# Altium project 555metronome.PrjPcb
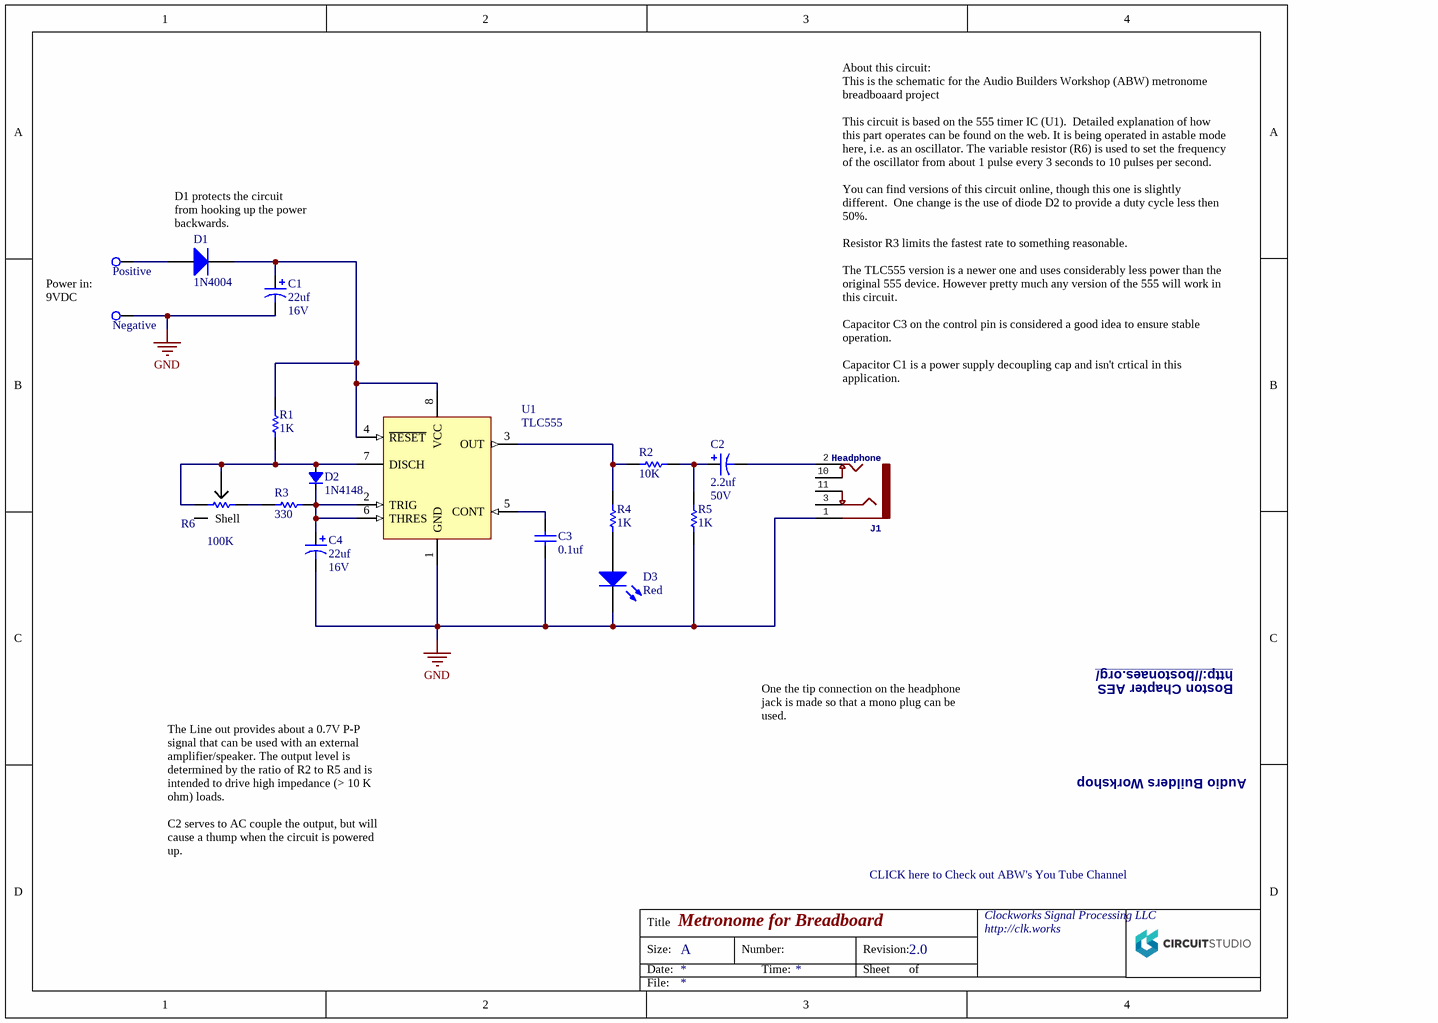
[diagram p0: met.breadboard.SchDoc]
1 sheet, 17 parts. Net scope: global (net labels, ports and power ports of the same name join across sheets).

## Sheet met.breadboard.SchDoc: Metronome for Breadboard
size A; Organization: Clockworks Signal Processing LLC; Address1: http://clk.works; Revision: 2.0

### Parts
C1  22uf  Voltage: 16V  [SL Radial cap 2mm. 5Dx11.2mm]
C2  2.2uf  Voltage: 50V  [SL Radial cap 2mm. 5Dx11.2mm Brown]
C3  0.1uf  [SL 3.8mm TH 5.1mm lead space]
C4  22uf  Voltage: 16V  [SL Radial cap 2mm. 5Dx11.2mm]
D1  1N4004  [SL DO-41]
D2  1N4148  [SL DO-35]
D3  value Red  [SL Green T13/4 LED]  (hidden comment: SL-D0006-A)
J1  Headphone  [SWITCHCRAFT_35RAPC4BHN2]
R1  1K  [SL Axial 1k 1/4W]
R2  10K  [SL Axial 10k 1/4W]
R3  330  [SL Axial 330 1/4W]
R4  1K  [SL Axial 1k 1/4W]
R5  1K  [SL Axial 1k 1/4W]
R6  100K  [SL 9MM POT]
TP1  Positive  [SL TEST POINT]  (no BOM)
TP2  Negative  [SL TEST POINT]  (no BOM)
U1  TLC555  [SL P0008A]

### Nets
GND: C1.2 C3.1 C4.2 D3.2(K) J1.1(SLEEVE) R5.1 TP2.1(TP) U1.1(GND)
NetC1_1: C1.1 D1.2(K) R1.2 U1.4(~{RESET}) U1.8(VCC)
NetC2_1: C2.1 R2.2 R5.2
NetC2_2: C2.2 J1.2(TIP)
NetC3_2: C3.2 U1.5(CONT)
NetC4_1: C4.1 D2.2(K) R3.2 U1.2(TRIG) U1.6(THRES)
NetD1_1: D1.1(A) TP1.1(TP)
NetD2_1: D2.1(A) R1.1 R6.1 R6.2 U1.7(DISCH)
NetD3_1: D3.1(A) R4.1
NetR2_1: R2.1 R4.2 U1.3(OUT)
NetR3_1: R3.1 R6.3

Not connected (* = marked no-connect by the designer): J1 3(RING) 10(TSH) 11(RSH); R6 0(Shell)

### Notes on the sheet
- (near D1) D1 protects the circuit from hooking up the power backwards.
- Power in: 9VDC
- (near J1) About this circuit:
  This is the schematic for the Audio Builders Workshop (ABW) metronome breadboaard project
  This circuit is based on the 555 timer IC (U1).  Detailed explanation of how this part operates can be found on the web. It is being operated in astable mode here, i.e. as an oscillator. The variable resistor (R6) is used to set the frequency of the oscillator from about 1 pulse every 3 seconds to 10 pulses per second.
  You can find versions of this circuit online, though this one is slightly different.  One change is the use of diode D2 to provide a duty cycle less then 50%.
  Resistor R3 limits the fastest rate to something reasonable.
  The TLC555 version is a newer one and uses considerably less power than the original 555 device. However pretty much any version of the 555 will work in this circuit.
  Capacitor C3 on the control pin is considered a good idea to ensure stable operation.
  Capacitor C1 is a power supply decoupling cap and isn't crtical in this application.
- Boston Chapter AES
- http://bostonaes.org/
- Audio Builders Workshop
- One the tip connection on the headphone jack is made so that a mono plug can be used.
- CLICK here to Check out ABW's You Tube Channel <https://www.youtube.com/channel/UCL2QPbpqc7WbapSZI18CsWg>
- The Line out provides about a 0.7V P-P signal that can be used with an external amplifier/speaker. The output level is determined by the ratio of R2 to R5 and is intended to drive high impedance (> 10 K ohm) loads.
  C2 serves to AC couple the output, but will cause a thump when the circuit is powered up.
- Title
- Size:
- Date:
- A
- Number:
- Time:
- Revision:
- Sheet
- of
- File:

### Library data of the parts
C1 = SL-C0018-A: 22 uF 16V radial 85C 5x12 mm; CSPManufacturer 1: Jameco; PartNumber 1: 158327; CSPID: C0018; Value: 22uf; Technology: L; Supplier 1: Digi-Key; Supplier Part Number 1: 399-6604-ND
C2 = SL-C0020-A: 2.2 uF 50V radial 85C 5x11mm; CSPManufacturer 1: Jameco; CSPID: C0020; Value: 2.2uf; Technology: L; PartNumber 1: *; Supplier 1: Mouser; Supplier Part Number 1: 598-225BPS050M
C3 = SL-C0019-A: .1 uF TH .2" lead; CSPManufacturer 1: Jameco; PartNumber 1: 544921; CSPID: C0018; Voltage: 50V; Value: 0.1uf; Technology: MLCC
C4 = SL-C0018-A: 22 uF 16V radial 85C 5x12 mm; CSPManufacturer 1: Jameco; CSPID: C0018; Value: 22uf; Technology: L; PartNumber 1: *
D1 = SL-D0004-A: 1 Amp TH General Purpose Rectifier 400V; CSPID: D0004; Published: 8-Jun-2000; LatestRevisionDate: 17-Jul-2002; LatestRevisionNote: Re-released for DXP Platform.; DatasheetVersion: 1998; PackageVersion: Aug-1999; PackageReference: DO-41; Publisher: Altium Limited; PackageDescription: Diode, Axial; Body 5.2 x 2.7 mm (LxDia. max), Lead Dia. 0.86 mm (max); Code_JEDEC: DO-204-AL; ComponentLink1Description: Manufacturer Link; ComponentLink1URL: http://www.fairchildsemi.com/; ComponentLink2Description: Datasheet; ComponentLink2URL: http://www.fairchildsemi.com/ds/1N%2F1N4001.pdf; Supplier 1: Digi-Key; Supplier 2: Mouser; Supplier Part Number 1: 641-1311-1-ND; Supplier Part Number 2: 621-1N4004G-T
D2 = SL-D0005-A: 100 mA TH General Purpose Diode; CSPID: D0005; DatasheetVersion: 1998; PackageReference: DO-35; PartNumber 1: 1N4148; Supplier 1: Mouser; Supplier Part Number 1: 78-1N4148
D3 = SL-D0006-A: Green T1 3/4 clear lens LED; CSPManufacturer 1: Lite-on; PartNumber 1: LTL307GE; CSPID: D0006; PackageDescription: 5mm T 1 3/4; Supplier 1: Digi-Key; Supplier Part Number 1: 160-1702-ND; Supplier 2: Mouser; Supplier Part Number 2: 859-LTL-307GE
J1 = CSP-J0022-A: Conn 3.5MM Stereo Jack F 5 POS Solder RA Thru-Hole 5 Terminal 1 Port; CSPManufacturer 1: Switchcraft; GateName_1: G$1; SymbolName_1: 35RAPC4BHN2; CSPID: J0022; LibraryName: 35RAPC4BHN2; DeviceSetName: 35RAPC4BHN2; PartNumber 1: 35RAPC4BHN2; Price: 1.00 USD; Availability: Good; Package: None; Supplier 1: Newark; Supplier 2: Mouser; Supplier 3: Digi-Key; Supplier Part Number 1: 96F9607; Supplier Part Number 2: 502-35RAPC4BHN2; Supplier Part Number 3: SC1459-ND
R1 R4 R5 = SL-R0016-A: 1K 1/4W TH; CSPID: R0016; Value: 1K; Supplier 1: Digi-Key; Supplier Part Number 1: CF14JT1K00CT-ND
R2 = SL-R0020-A: 10K 1/4W TH; Partnumber 1: CF14JT10K0; CSPID: R0020; Value: 10K; Supplier 1: Newark; Supplier 2: Digi-Key; Supplier Part Number 1: 78Y4255; Supplier Part Number 2: CF14JT10K0CT-ND
R3 = SL-R0019-A: 330 1/4W TH; CSPManufacturer 1: Stackpole; Partnumber 1: CF14JT330R; CSPID: R0019; Value: 330; Supplier 1: Newark; Supplier Part Number 1: 72K6194; Supplier 2: Digi-Key; Supplier Part Number 2: CF14JT330RCT-ND
R6 = SL-RV0001-A: 50 mW 9mm PCB mount linear taper pot; PartNumber 1: RV09AF-40-20K-B100K; CSPManufacturer 1: Alpha Electronics; CSPID: RV0001; Value: 100K; Supplier 1: Mouser; Supplier Part Number 1: 317-2090F-100K
TP1 TP2 = SL-X0005-A: Connection point; CSPID: X0005
U1 = SL-U0007-A: 555 Timer 8 pin DIP, low power version; CSPManufacturer 1: Texas Instruments; PartNumber 1: TLC555CP; CSPID: U0007; Supplier 1: Mouser; Supplier 2: Newark; Supplier 3: Digi-Key; Supplier Part Number 1: 595-TLC555CP; Supplier Part Number 2: 36K2064; Supplier Part Number 3: 296-1857-5-ND